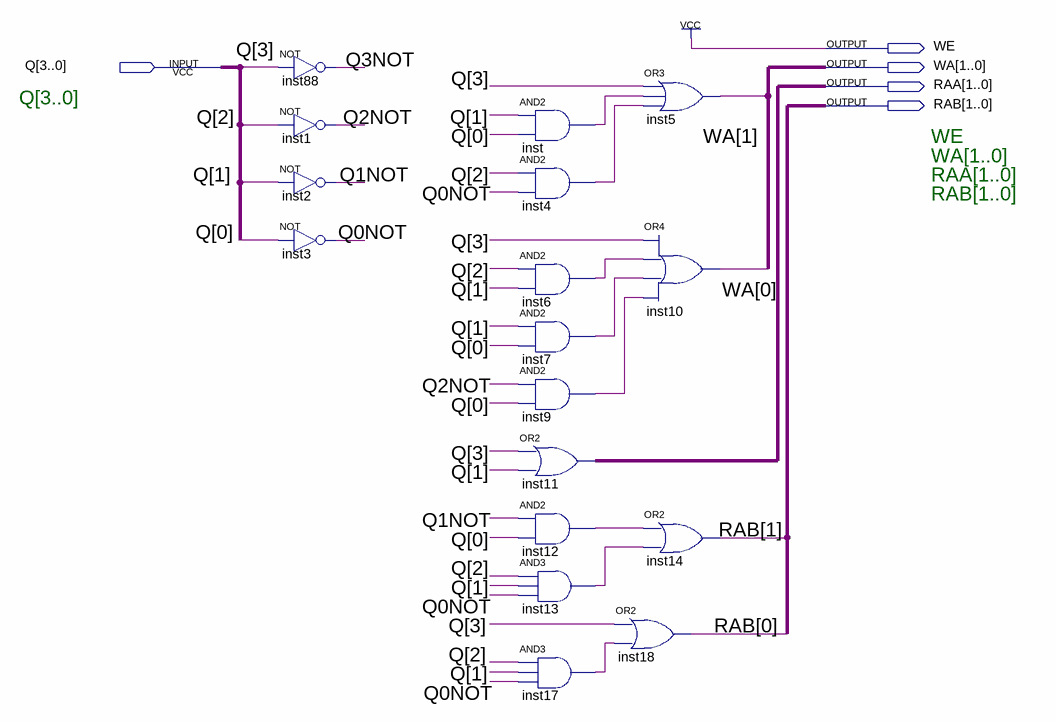
[diagram p0: schematic sheet]
// Quartus schematic RF_CTRL.bdf as structural Verilog: 17 symbols, 5 pins
module RF_CTRL (
  input  [3:0] Q,
  output WE,
  output [1:0] WA,
  output [1:0] RAA,
  output [1:0] RAB
);

  wire inst4_out, inst6_out, inst7_out, inst9_out, inst12_out, inst13_out, inst17_out, inst_out, Q0NOT,
       Q1NOT, Q2NOT, Q3NOT;

  not inst88 (Q3NOT, Q[3]);
  not inst1 (Q2NOT, Q[2]);
  not inst2 (Q1NOT, Q[1]);
  not inst3 (Q0NOT, Q[0]);
  and inst (inst_out, Q[1], Q[0]);
  and inst4 (inst4_out, Q[2], Q0NOT);
  and inst6 (inst6_out, Q[2], Q[1]);
  and inst7 (inst7_out, Q[1], Q[0]);
  and inst9 (inst9_out, Q2NOT, Q[0]);
  assign RAA = {2{Q[3]}} | {2{Q[1]}};  // OR2 inst11, 2 bits wide
  and inst12 (inst12_out, Q1NOT, Q[0]);
  and inst13 (inst13_out, Q[2], Q[1], Q0NOT);
  and inst17 (inst17_out, Q[2], Q[1], Q0NOT);
  or inst18 (RAB[0], Q[3], inst17_out);
  or inst5 (WA[1], Q[3], inst_out, inst4_out);
  or inst10 (WA[0], Q[3], inst6_out, inst7_out, inst9_out);
  or inst14 (RAB[1], inst12_out, inst13_out);

  assign WE = 1'b1;

  // Notes on the sheet:
  //   Q[3..0]
  //   WE
  //   WA[1..0]
  //   RAA[1..0]
  //   RAB[1..0]
endmodule
